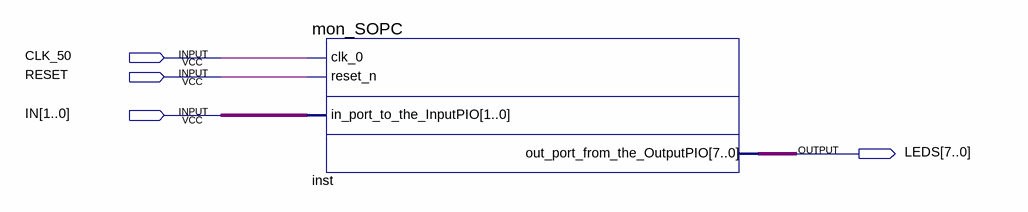
[diagram p0: schematic sheet]
// Quartus schematic Test.bdf as structural Verilog: 1 symbols, 4 pins
module Test (
  input  CLK_50,
  input  RESET,
  input  [1:0] IN,
  output [7:0] LEDS
);

  mon_SOPC inst (.clk_0(CLK_50), .reset_n(RESET), .in_port_to_the_InputPIO(IN), .out_port_from_the_OutputPIO(LEDS));
endmodule
